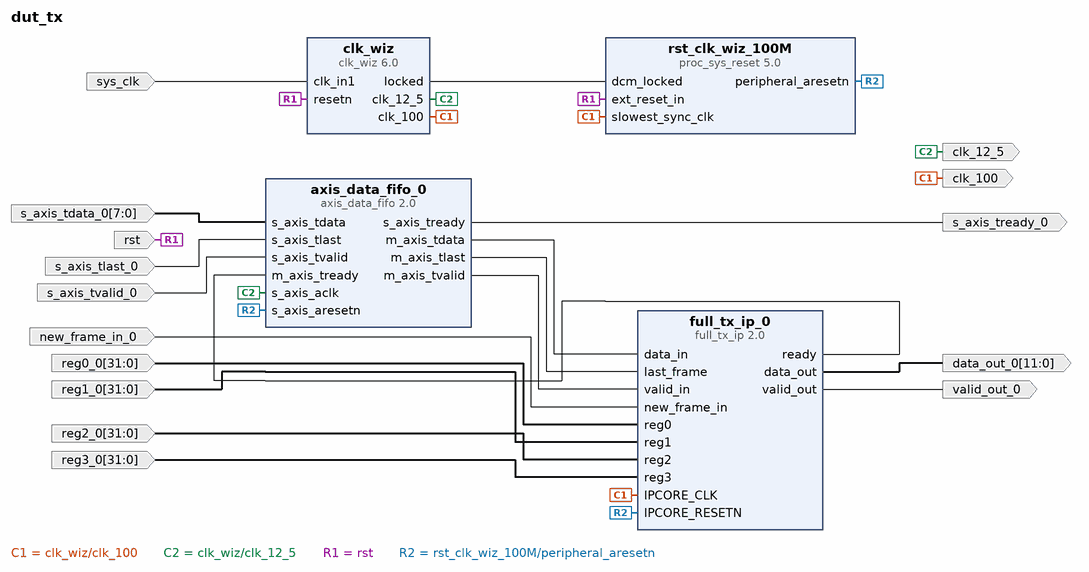
[diagram p0: block diagram of the top level]
# Vivado block design dut_tx, xc7z010clg400-1, Vivado 2023.2
create_bd_design dut_tx

create_bd_port -dir I -type clk sys_clk
set_property -dict {CONFIG.FREQ_HZ 100000000} [get_bd_ports sys_clk]
create_bd_port -dir I -type rst rst
set_property -dict {CONFIG.POLARITY ACTIVE_LOW} [get_bd_ports rst]
create_bd_port -dir I new_frame_in_0
create_bd_port -dir O -from 11 -to 0 data_out_0
create_bd_port -dir O valid_out_0
create_bd_port -dir I -from 7 -to 0 s_axis_tdata_0
create_bd_port -dir I s_axis_tlast_0
create_bd_port -dir I s_axis_tvalid_0
create_bd_port -dir O s_axis_tready_0
create_bd_port -dir I -from 31 -to 0 reg0_0
create_bd_port -dir I -from 31 -to 0 reg1_0
create_bd_port -dir I -from 31 -to 0 reg2_0
create_bd_port -dir I -from 31 -to 0 reg3_0
create_bd_port -dir O -type clk clk_100
create_bd_port -dir O -type clk clk_12_5

create_bd_cell -type ip -vlnv user.org:ip:full_tx_ip:2.0 full_tx_ip_0
create_bd_cell -type ip -vlnv xilinx.com:ip:clk_wiz:6.0 clk_wiz
set_property -dict [list \
  CONFIG.CLKOUT1_DRIVES BUFG \
  CONFIG.CLKOUT1_JITTER 130.958 \
  CONFIG.CLKOUT1_PHASE_ERROR 98.575 \
  CONFIG.CLKOUT2_DRIVES BUFG \
  CONFIG.CLKOUT2_JITTER 200.764 \
  CONFIG.CLKOUT2_PHASE_ERROR 98.575 \
  CONFIG.CLKOUT2_REQUESTED_OUT_FREQ 12.5 \
  CONFIG.CLKOUT2_REQUESTED_PHASE 225 \
  CONFIG.CLKOUT2_USED true \
  CONFIG.CLKOUT3_DRIVES BUFG \
  CONFIG.CLKOUT4_DRIVES BUFG \
  CONFIG.CLKOUT5_DRIVES BUFG \
  CONFIG.CLKOUT6_DRIVES BUFG \
  CONFIG.CLKOUT7_DRIVES BUFG \
  CONFIG.CLK_OUT1_PORT clk_100 \
  CONFIG.CLK_OUT2_PORT clk_12_5 \
  CONFIG.ENABLE_CLOCK_MONITOR false \
  CONFIG.FEEDBACK_SOURCE FDBK_AUTO \
  CONFIG.MMCM_BANDWIDTH OPTIMIZED \
  CONFIG.MMCM_CLKFBOUT_MULT_F 10.000 \
  CONFIG.MMCM_CLKOUT0_DIVIDE_F 10.000 \
  CONFIG.MMCM_CLKOUT1_DIVIDE 80 \
  CONFIG.MMCM_CLKOUT1_PHASE 225.000 \
  CONFIG.MMCM_COMPENSATION ZHOLD \
  CONFIG.NUM_OUT_CLKS 2 \
  CONFIG.PRIMITIVE MMCM \
  CONFIG.RESET_PORT resetn \
  CONFIG.RESET_TYPE ACTIVE_LOW \
  CONFIG.SECONDARY_SOURCE Single_ended_clock_capable_pin \
  CONFIG.USE_DYN_PHASE_SHIFT false \
  CONFIG.USE_LOCKED true \
  CONFIG.USE_PHASE_ALIGNMENT true \
] [get_bd_cells clk_wiz]
create_bd_cell -type ip -vlnv xilinx.com:ip:proc_sys_reset:5.0 rst_clk_wiz_100M
create_bd_cell -type ip -vlnv xilinx.com:ip:axis_data_fifo:2.0 axis_data_fifo_0
set_property -dict {CONFIG.HAS_TLAST 1} [get_bd_cells axis_data_fifo_0]

# ---- connections ----

connect_bd_net [get_bd_pins axis_data_fifo_0/m_axis_tdata] [get_bd_pins full_tx_ip_0/data_in]
connect_bd_net [get_bd_pins axis_data_fifo_0/m_axis_tlast] [get_bd_pins full_tx_ip_0/last_frame]
connect_bd_net [get_bd_pins axis_data_fifo_0/m_axis_tvalid] [get_bd_pins full_tx_ip_0/valid_in]
connect_bd_net [get_bd_pins axis_data_fifo_0/s_axis_tready] [get_bd_ports s_axis_tready_0]
connect_bd_net -net clk_100MHz_1 [get_bd_ports sys_clk] [get_bd_pins clk_wiz/clk_in1]
connect_bd_net [get_bd_pins clk_wiz/clk_100] \
  [get_bd_pins full_tx_ip_0/IPCORE_CLK] [get_bd_ports clk_100] [get_bd_pins rst_clk_wiz_100M/slowest_sync_clk]
connect_bd_net [get_bd_pins clk_wiz/clk_12_5] [get_bd_pins axis_data_fifo_0/s_axis_aclk] [get_bd_ports clk_12_5]
connect_bd_net [get_bd_pins clk_wiz/locked] [get_bd_pins rst_clk_wiz_100M/dcm_locked]
connect_bd_net [get_bd_pins full_tx_ip_0/data_out] [get_bd_ports data_out_0]
connect_bd_net [get_bd_pins full_tx_ip_0/ready] [get_bd_pins axis_data_fifo_0/m_axis_tready]
connect_bd_net [get_bd_pins full_tx_ip_0/valid_out] [get_bd_ports valid_out_0]
connect_bd_net -net new_frame_in_0_1 [get_bd_ports new_frame_in_0] [get_bd_pins full_tx_ip_0/new_frame_in]
connect_bd_net -net reg0_0_1 [get_bd_ports reg0_0] [get_bd_pins full_tx_ip_0/reg0]
connect_bd_net -net reg1_0_1 [get_bd_ports reg1_0] [get_bd_pins full_tx_ip_0/reg1]
connect_bd_net -net reg2_0_1 [get_bd_ports reg2_0] [get_bd_pins full_tx_ip_0/reg2]
connect_bd_net -net reg3_0_1 [get_bd_ports reg3_0] [get_bd_pins full_tx_ip_0/reg3]
connect_bd_net -net reset_rtl_1 [get_bd_ports rst] [get_bd_pins rst_clk_wiz_100M/ext_reset_in] [get_bd_pins clk_wiz/resetn]
connect_bd_net [get_bd_pins rst_clk_wiz_100M/peripheral_aresetn] \
  [get_bd_pins full_tx_ip_0/IPCORE_RESETN] [get_bd_pins axis_data_fifo_0/s_axis_aresetn]
connect_bd_net -net s_axis_tdata_0_1 [get_bd_ports s_axis_tdata_0] [get_bd_pins axis_data_fifo_0/s_axis_tdata]
connect_bd_net -net s_axis_tlast_0_1 [get_bd_ports s_axis_tlast_0] [get_bd_pins axis_data_fifo_0/s_axis_tlast]
connect_bd_net -net s_axis_tvalid_0_1 [get_bd_ports s_axis_tvalid_0] [get_bd_pins axis_data_fifo_0/s_axis_tvalid]

validate_bd_design
save_bd_design
